# EAGLE design hm11bo (EAGLE 6.5.0)
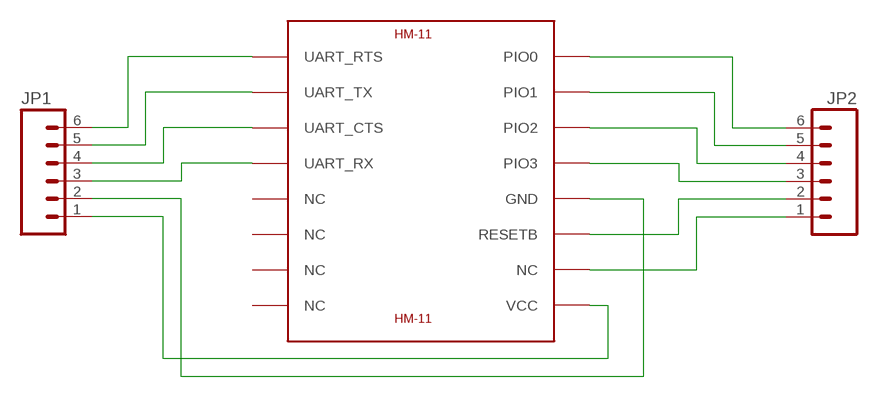
[diagram p0: schematic, sheet 1]

## Parts
JP1  M06SIP  [1X06]
JP2  M06SIP  [1X06]
U$1  HM-11  [HM-11]

## Nets
CTS: JP1.4 U$1.UART_CTS
GND: JP1.2 U$1.GND
NC: JP2.1 U$1.NC@10(NC)
PIO0: JP2.6 U$1.PIO0
PIO1: JP2.5 U$1.PIO1
PIO2: JP2.4 U$1.PIO2
PIO3: JP2.3 U$1.PIO3
RESETB: JP2.2 U$1.RESETB
RTS: JP1.6 U$1.UART_RTS
RX: JP1.3 U$1.UART_RX
TX: JP1.5 U$1.UART_TX
VCC: JP1.1 U$1.VCC
Unconnected: U$1.NC@5(NC) U$1.NC@6(NC) U$1.NC@7(NC) U$1.NC@8(NC)

## Library data of the parts
JP1 JP2 = SparkFun-Connectors:M06: Header 6 Standard 6-pin 0.1" header. Use with straight break away headers (SKU : PRT-00116), right angle break away headers (PRT-00553), swiss pins (PRT-00743), machine pins (PRT-00117), and female headers (PRT-00115). Molex polarized connector foot print use with SKU : PRT-08094 with associated crimp pins and housings. NOTES ON THE VARIANTS LOCK and LOCK_LONGPADS... This footprint was designed to help hold the alignment of a through-hole component (i.e. 6-pin header) while soldering it into place. You may notice that each hole has been shifted either up or down by 0.005 of an inch from it's more standard position (which is a perfectly straight line). This slight alteration caused the pins (the squares in the middle) to touch the edges of the holes. Because they are alternating, it causes a "brace" to hold the component in place. 0.005 has proven to be the perfect amount of "off-center" position when using our standard breakaway headers. Although looks a little odd when you look at the bare footprint, once you have a header in there, the alteration is very hard to notice. Also,if you push a header all the way into place, it is covered up entirely on the bottom side. This idea of altering the position of holes to aid alignment will be further integrated into the Sparkfun Library for other footprints. It can help hold any component with 3 or more connection pins.
U$1 = hm-11:HM-11: JNHuaMao HM-11 Bluetooth 4.0 Transceiver based on TI CC2540/CC2541

## Board
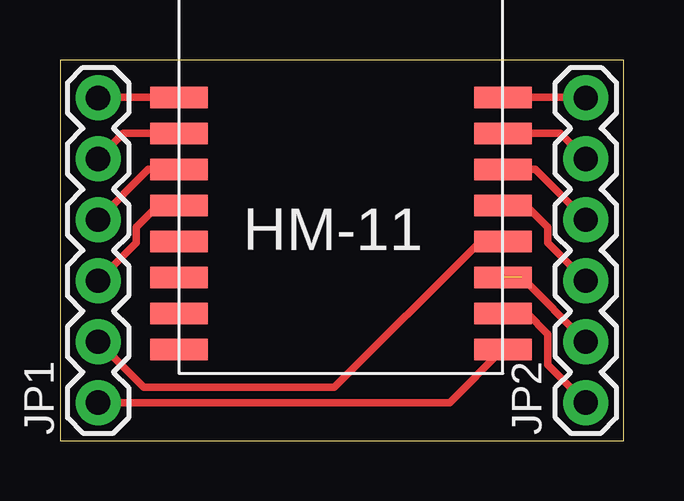
[diagram p1: board, top side]
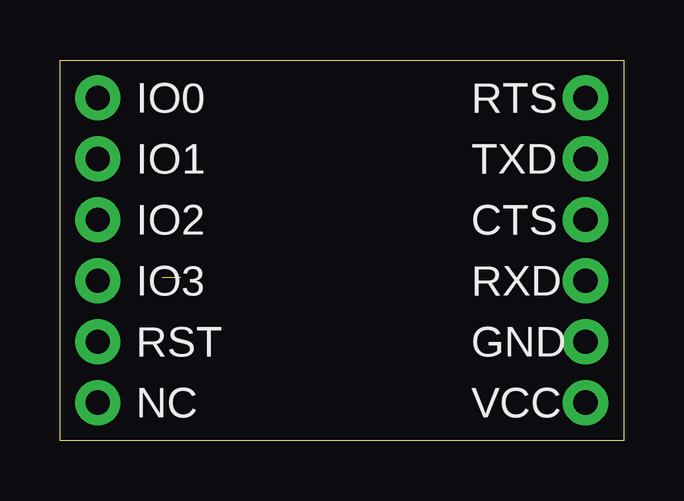
[diagram p2: board, bottom side, seen from below]

Size 23.48 x 15.87 mm. Coordinates in mm from the lower left corner, seen from the top.
Outline: 0,0 23.48,0 23.48,15.87 0,15.87 0,0
Copper layers (1*2*15*16): Top 0.035mm / dielectric 0.2mm / layer 2 0.0175mm / dielectric 1.1mm / layer 15 0.0175mm / dielectric 0.2mm / Bottom 0.035mm
Design rules "SeeedStudio_DRU_no_angle_20130527": minimum track width 6mil, minimum drill 12mil, track to track 6mil, track to pad 6mil, pad to pad 6mil, via to via 6mil, smd to smd 0mil, copper to edge 10mil, drill to drill 10mil, minimum pad ring 6mil, minimum via ring 6mil, stop-mask expansion 2mil, vias tented up to drill 25mil, thermal gap 10mil

### Footprints (pad centres in the part's own frame; a part is rotated, then mirrored left to right if it is on the bottom)
1X06 = drill 1.016 pad 1.88: 1 0,0; 2 2.54,0; 3 5.08,0; 4 7.62,0; 5 10.16,0; 6 12.7,0
HM-11 = smd 2.4 x 0.9: GND 6.5,0; NC@5 -7,0; NC@6 -7,-1.5; NC@7 -7,-3; NC@8 -7,-4.5; NC@10 6.5,-3; PIO0 6.5,6; PIO1 6.5,4.5; PIO2 6.5,3; PIO3 6.5,1.5; RESETB 6.5,-1.5; UART_CTS -7,3; UART_RTS -7,6; UART_RX -7,1.5; UART_TX -7,4.5; VCC 6.5,-4.5

### Placement (x,y rotation side)
JP1  1.59,1.59 90 top
JP2  21.91,1.59 90 top
U$1  11.95,8.31 0 top

### Tracks (layer width: path | path; a pad name or v marks a point on that pad's centre or on a via)
CTS
  Top 0.305: JP1.4 3.69,11.31 U$1.UART_CTS
GND
  Top 0.305: U$1.GND 18.4,8.26 17.46,8.26 11.43,2.22 3.49,2.22 JP1.2
NC
  Top 0.305: U$1.NC@10 19.05,5.31 19.46,5.31 20.32,4.45 20.32,3.18 JP2.1
PIO0
  Top 0.305: JP2.6 21.89,14.31 U$1.PIO0
PIO1
  Top 0.305: JP2.5 20.85,12.81 U$1.PIO1
PIO2
  Top 0.305: JP2.4 19.81,11.31 U$1.PIO2
PIO3
  Top 0.305: JP2.3 20.32,8.26 20.32,8.89 19.4,9.81 U$1.PIO3
RESETB  (1 unrouted)
  Top 0.305: JP2.2 19.23,6.81
RTS
  Top 0.305: JP1.6 1.61,14.31 U$1.UART_RTS
RX
  Top 0.305: JP1.3 3.18,8.26 3.18,8.89 4.09,9.81 U$1.UART_RX
TX
  Top 0.305: JP1.5 2.65,12.81 U$1.UART_TX
VCC
  Top 0.305: U$1.VCC 16.23,1.59 JP1.1

### Text on the board
tPlace: HM-11
bPlace: RTS | IO0 | TXD | IO1 | CTS | IO2 | RXD | IO3 | GND | RST | VCC | NC